# Altium project DiPho_digital.PrjPcb
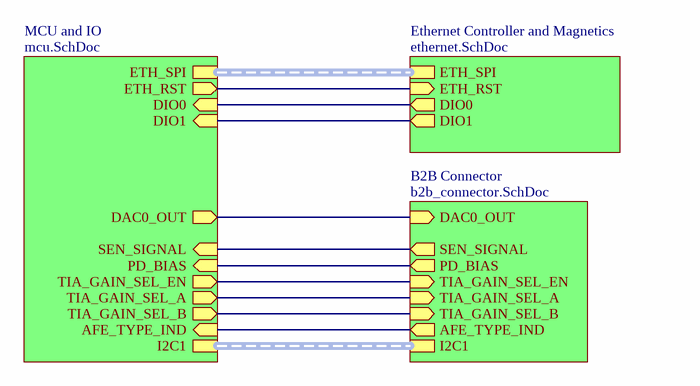
[diagram p0: DiPho_digital.SchDoc]
4 sheets, 65 parts. Net scope: hierarchical (ports join the sheet entries above them; power ports are global).
Board file: DiPho_digital.PcbDoc
Sheets:
  DiPho_digital.SchDoc
    MCU and IO = mcu.SchDoc
    Ethernet Controller and Magnetics = ethernet.SchDoc
    B2B Connector = b2b_connector.SchDoc

## Sheet DiPho_digital.SchDoc: DiPho digital
size 420 x 297 mm; Author: P. Daniel; CompanyName: WUT ISE; DrawnBy: P. Daniel; Organization: WUT ISE; Address1: WUT ISE; Address2: Nowowiejska 15/19 00-665 Warsaw; Address3: piotrmaciejdaniel@gmail.com; Revision: 1; SheetNumber: 1; SheetTotal: 4; ModifiedBy: -; CreateDate: 10-12.2021; CheckedDate: -; Title2: top schematic; DivGrp: WUT ISE; Designer: Piotr Daniel

### Sub-sheets
B2B Connector = b2b_connector.SchDoc: I2C1 (harness I2C), AFE_TYPE_IND (out), TIA_GAIN_SEL_B (in), TIA_GAIN_SEL_A (in), PD_BIAS (out), SEN_SIGNAL (out), DAC0_OUT (in), TIA_GAIN_SEL_EN (in)
Ethernet Controller and Magnetics = ethernet.SchDoc: ETH_SPI (harness ETH_SPI), ETH_RST (in), DIO0 (out), DIO1 (out)
MCU and IO = mcu.SchDoc: I2C1 (harness I2C), ETH_SPI (harness ETH_SPI), ETH_RST (out), AFE_TYPE_IND (in), TIA_GAIN_SEL_A (out), PD_BIAS (in), DAC0_OUT (out), TIA_GAIN_SEL_B (out), TIA_GAIN_SEL_EN (out), SEN_SIGNAL (in), DIO0 (in), DIO1 (in)

### Nets
AFE_TYPE_IND: sheet MCU and IO/AFE_TYPE_IND, sheet B2B Connector/AFE_TYPE_IND
DAC0_OUT: sheet MCU and IO/DAC0_OUT, sheet B2B Connector/DAC0_OUT
DIO0: sheet MCU and IO/DIO0, sheet Ethernet Controller and Magnetics/DIO0
DIO1: sheet MCU and IO/DIO1, sheet Ethernet Controller and Magnetics/DIO1
ETH_RST: sheet MCU and IO/ETH_RST, sheet Ethernet Controller and Magnetics/ETH_RST
PD_BIAS: sheet MCU and IO/PD_BIAS, sheet B2B Connector/PD_BIAS
SEN_SIGNAL: sheet MCU and IO/SEN_SIGNAL, sheet B2B Connector/SEN_SIGNAL
TIA_GAIN_SEL_A: sheet MCU and IO/TIA_GAIN_SEL_A, sheet B2B Connector/TIA_GAIN_SEL_A
TIA_GAIN_SEL_B: sheet MCU and IO/TIA_GAIN_SEL_B, sheet B2B Connector/TIA_GAIN_SEL_B
TIA_GAIN_SEL_EN: sheet MCU and IO/TIA_GAIN_SEL_EN, sheet B2B Connector/TIA_GAIN_SEL_EN

### Buses and harness runs
harness sheet B2B Connector/I2C1 = sheet MCU and IO/I2C1
harness sheet Ethernet Controller and Magnetics/ETH_SPI = sheet MCU and IO/ETH_SPI

### Notes on the sheet
- Project/Equipment
- Document
- Designer
- Drawn by
- Check.by
- Copyright WUT ISE 2021.
  This documentation describes Open Hardware and is licensed under the CERN OHL v.1.1. You may redistribute and modify this documentation under the terms of the CERN OHL v.1.1. (http://ohwr.org/CERNOHL). This documentation is distributed WITHOUT ANY EXPRESS OR IMPLIED WARRANTY, INCLUDING OF MERCHANTABILITY, SATISFACTORY QUALITY AND FITNESS FOR A PARTICULAR PURPOSE. Please see the CERN OHL v.1.1 for applicable conditions.
- Contact
- File
- Last Mod.
- Print Date
- Sheet
- Size
- A3
- of
- Rev

## Sheet mcu.SchDoc: DiPho digital
size 420 x 297 mm; Author: P. Daniel; CompanyName: WUT ISE; DrawnBy: P. Daniel; Organization: WUT ISE; Address1: WUT ISE; Address2: Nowowiejska 15/19 00-665 Warsaw; Address3: piotrmaciejdaniel@gmail.com; Revision: 1; SheetNumber: 2; SheetTotal: 4; ModifiedBy: -; CreateDate: 10-12.2021; CheckedDate: -; Title2: MCU and IO; DivGrp: WUT ISE; Designer: Piotr Daniel; ModifiedDate: -; ProjectName: Sensor Box
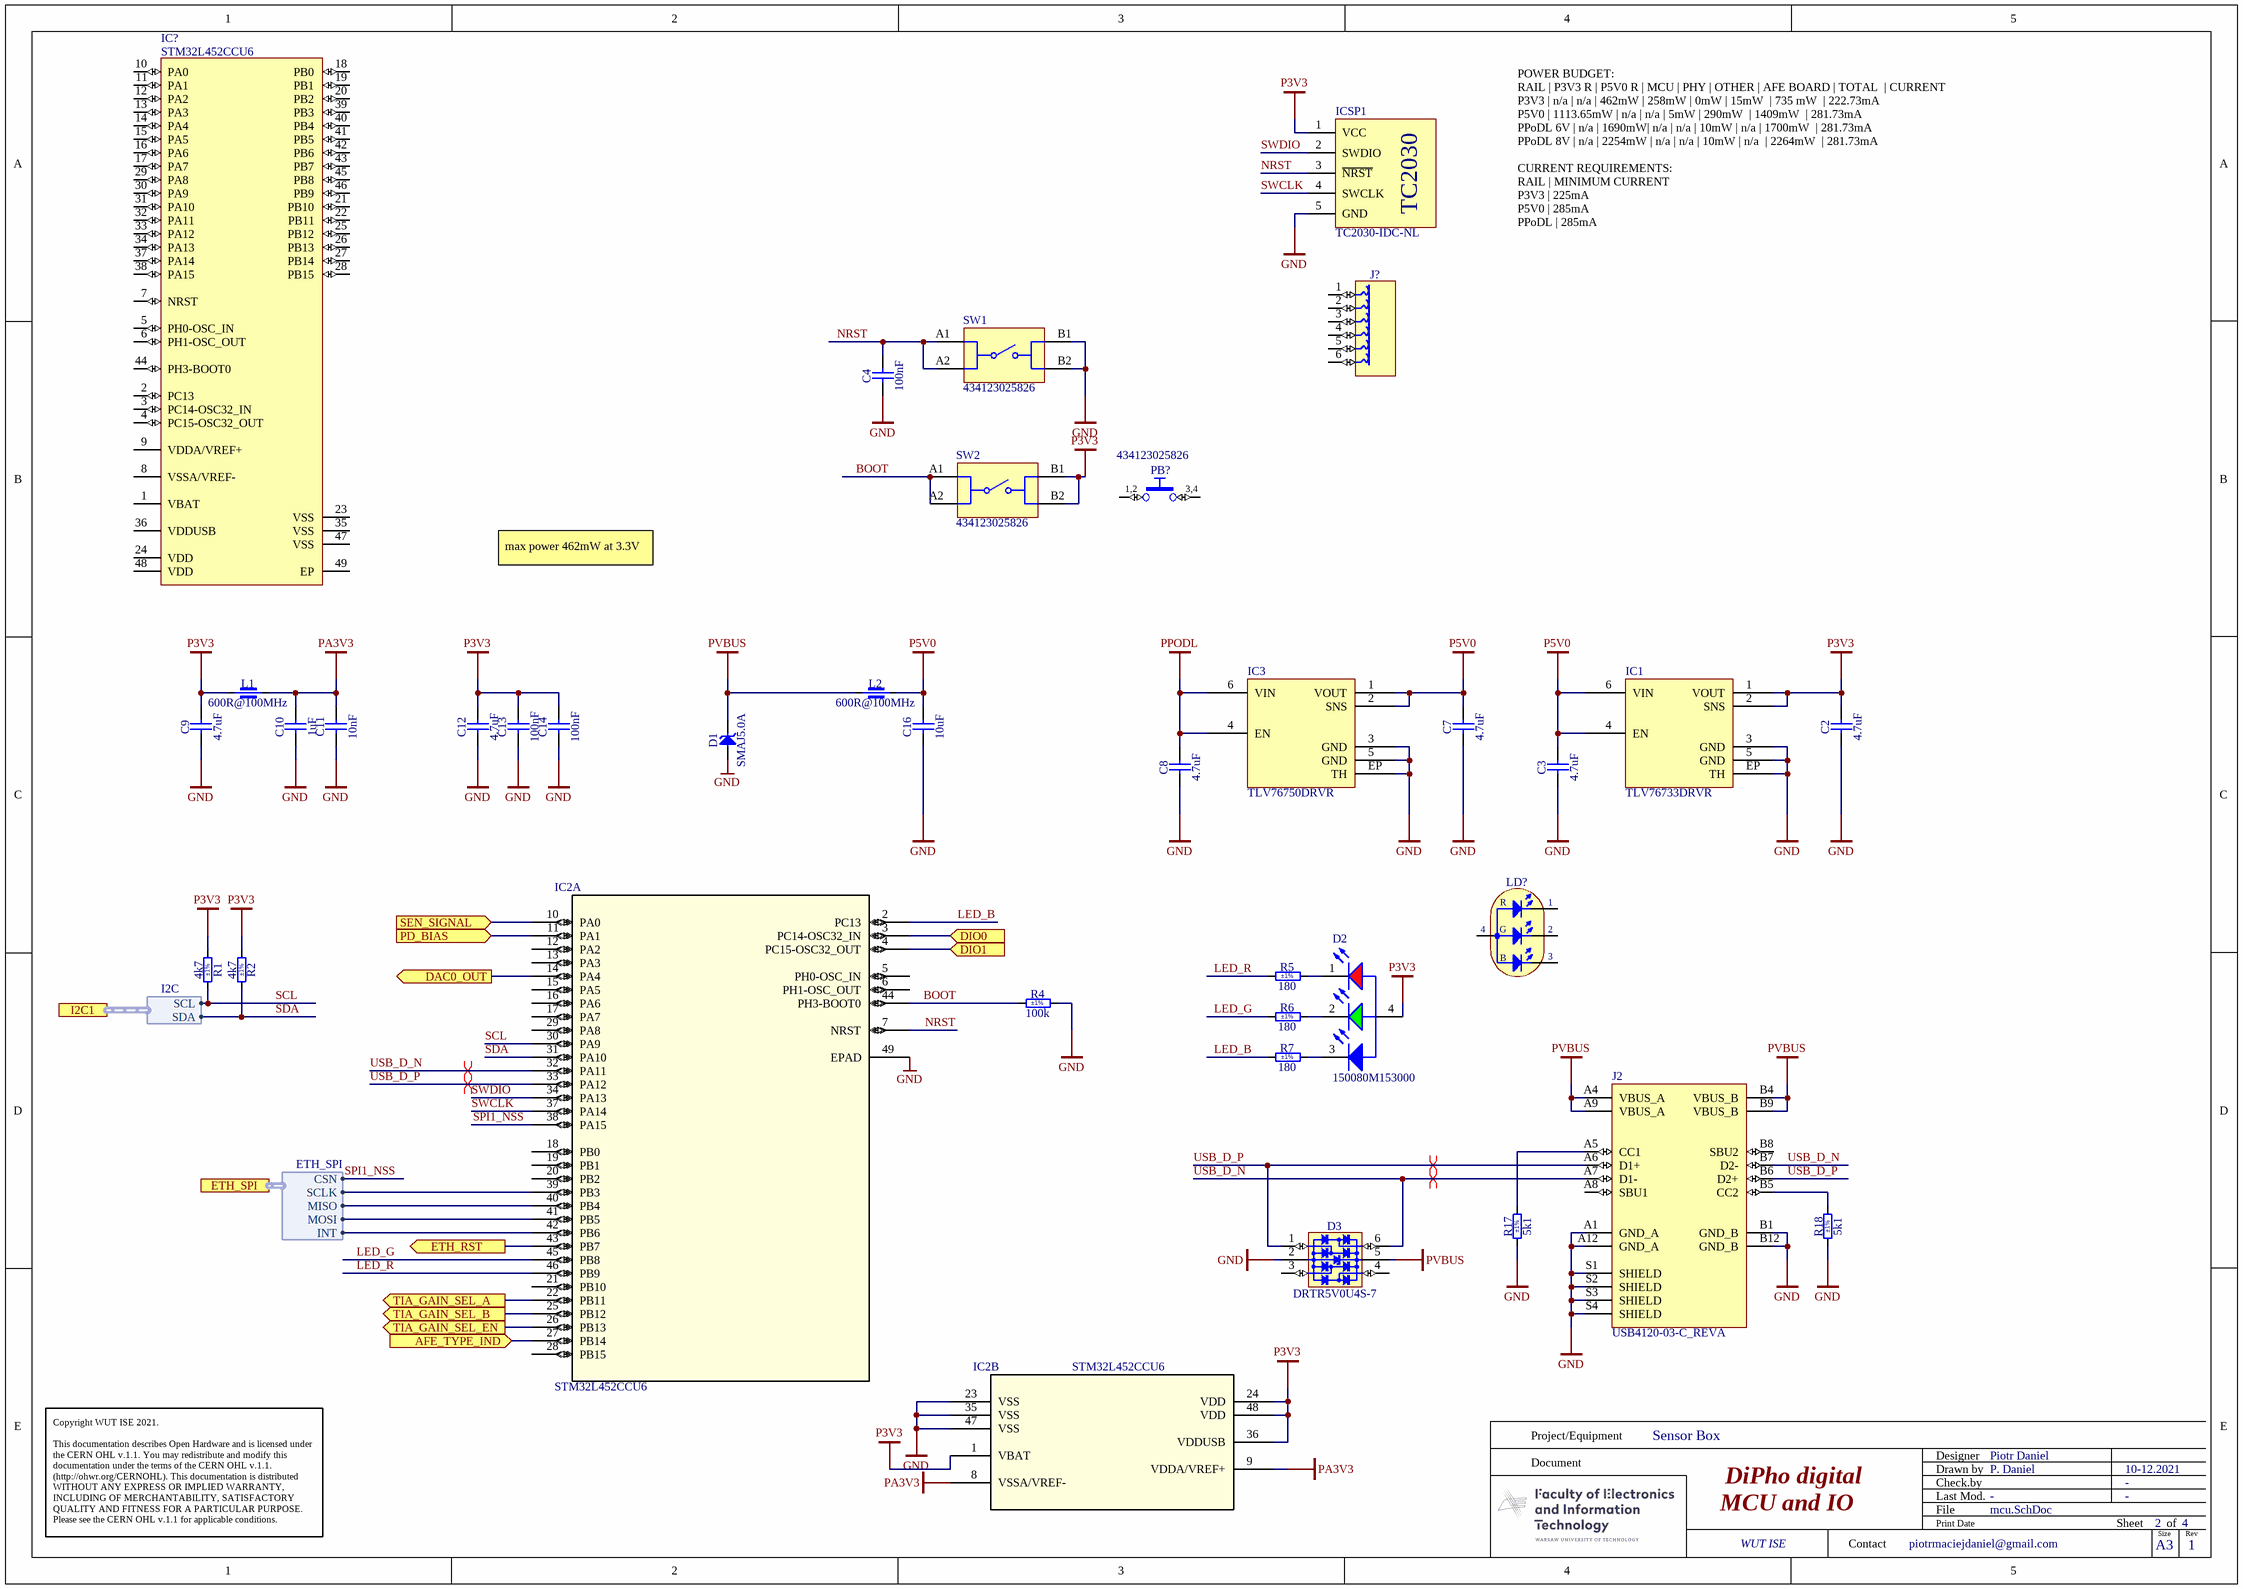
[diagram p1: mcu.SchDoc]

### Parts
(Parts that share a designator on the sheet are numbered #1, #2 ... from top to bottom, then left to right.)
C2  4.7uF  [CAPC1709X95N]
C3  4.7uF  [CAPC1709X95N]
C4  100nF  [CAPC1005X55N]
C7  4.7uF  [CAPC1709X95N]
C8  4.7uF  [CAPC1709X95N]
C9  4.7uF  [CAPC1709X95N]
C10  1uF  [CAPC1005X55N]
C11  10nF  [CAPC1005X55N]
C12  4.7uF  [CAPC1709X95N]
C13  100nF  [CAPC1005X55N]
C14  100nF  [CAPC1005X55N]
C16  10uF  [CAPC1608X80N]
D1  SMAJ5.0A  [DIOM5226X262N]
D2  150080M153000  [WL-SFCD_0805]
D3  DRTR5V0U4S-7  [SOT65P210X110-6N]
IC1  TLV76733DRVR  [SON65P200X80_HS-7N]
IC2  STM32L452CCU6  [UFQFPN48-7x7mm_STM-L]  (parts A,B of 2)
IC3  TLV76750DRVR  [SON65P200X80_HS-7N]
IC?  STM32L452CCU6  [QFN50P700X700X60-49N-S570]
ICSP1  TC2030-IDC-NL  [TC2030-IDC-NL]
J2  USB4120-03-C_REVA  [GCT_USB4120-03-C_REVA]
J?  TC2030-MCP  [TC2030-MCP-NL]  (value not drawn)
L1  600R@100MHz  [INDC1005X55N]
L2  600R@100MHz  [INDC1005X55N]
LD?  Red/Green/Blue  [LED_WURTH_150080M153000]  (value not drawn)
PB?  Manufacturer Part Number: 434123025826  [PB_WURTH_434123025826]  (hidden comment: Push Button)
R1  4k7  Tolerance: ±1%  [RESC1005X40N]
R2  4k7  Tolerance: ±1%  [RESC1005X40N]
R4  100k  Tolerance: ±1%  [RESC1005X40N]
R5  180  Tolerance: ±1%  [RESC1005X40N]
R6  180  Tolerance: ±1%  [RESC1005X40N]
R7  180  Tolerance: ±1%  [RESC1005X40N]
R17  5k1  Tolerance: ±1%  [RESC1005X40N]
R18  5k1  Tolerance: ±1%  [RESC1005X40N]
SW1#1  434123025826  [WS-TASV_L4.2W3.2H2.5_4341x30258x6]
SW2  434123025826  [WS-TASV_L4.2W3.2H2.5_4341x30258x6]

### Ports
AFE_TYPE_IND (in), DAC0_OUT (out), DIO0 (in), DIO1 (in), ETH_RST (out), ETH_SPI (harness ETH_SPI), I2C1 (harness I2C), PD_BIAS (in), SEN_SIGNAL (in), TIA_GAIN_SEL_A (out), TIA_GAIN_SEL_B (out), TIA_GAIN_SEL_EN (out)

### Harnesses
I2C: SCL, SDA
ETH_SPI: INT, SCLK, MISO, MOSI, CSN

### Nets
GND: C2.1 C3.1 C4.1 C7.1 C8.1 C9.1 C10.1 C11.1 C12.1 C13.1 C14.1 C16.1 D1.2(A) D3.2(GND) IC1.3(GND) IC1.5(GND) IC1.EP(TH) IC2.23(VSS) IC2.35(VSS) IC2.47(VSS) IC2.49(EPAD) IC3.3(GND) IC3.5(GND) IC3.EP(TH) ICSP1.5(GND) J2.A1(GND_A) J2.A12(GND_A) J2.B1(GND_B) J2.B12(GND_B) J2.S1(SHIELD) J2.S2(SHIELD) J2.S3(SHIELD) J2.S4(SHIELD) R4.2 R17.1 R18.1 SW1#1.B1 SW1#1.B2
P3V3: C2.2 C9.2 C12.2 C13.2 C14.2 D2.4(A) IC1.1(VOUT) IC1.2(SNS) IC2.1(VBAT) IC2.24(VDD) IC2.36(VDDUSB) IC2.48(VDD) ICSP1.1(VCC) L1.1 R1.2 R2.2 SW2.B1 SW2.B2
P5V0: C3.2 C7.2 C16.2 IC1.4(EN) IC1.6(VIN) IC3.1(VOUT) IC3.2(SNS) L2.2
PA3V3: C10.2 C11.2 IC2.8(VSSA/VREF-) IC2.9(VDDA/VREF+) L1.2
PPODL: C8.2 IC3.4(EN) IC3.6(VIN)
PVBUS: D1.1(C) D3.5(VBUS) J2.A4(VBUS_A) J2.A9(VBUS_A) J2.B4(VBUS_B) J2.B9(VBUS_B) L2.1
AFE_TYPE_IND: IC2.27(PB14) ; port AFE_TYPE_IND
BOOT: IC2.44(PH3-BOOT0) R4.1 SW2.A1 SW2.A2
DAC0_OUT: IC2.14(PA4) ; port DAC0_OUT
DIO0: IC2.3(PC14-OSC32_IN) ; port DIO0
DIO1: IC2.4(PC15-OSC32_OUT) ; port DIO1
ETH_RST: IC2.43(PB7) ; port ETH_RST
LED_B: IC2.2(PC13) R7.1
LED_G: IC2.45(PB8) R6.1
LED_R: IC2.46(PB9) R5.1
NRST: C4.2 IC2.7(NRST) ICSP1.3(~{NRST}) SW1#1.A1 SW1#1.A2
PD_BIAS: IC2.11(PA1) ; port PD_BIAS
SCL: IC2.30(PA9) R1.1 ; port I2C1.SCL
SDA: IC2.31(PA10) R2.1 ; port I2C1.SDA
SEN_SIGNAL: IC2.10(PA0) ; port SEN_SIGNAL
SPI1_NSS: IC2.38(PA15) ; port ETH_SPI.CSN
SWCLK: IC2.37(PA14) ICSP1.4(SWCLK)
SWDIO: IC2.34(PA13) ICSP1.2(SWDIO)
TIA_GAIN_SEL_A: IC2.22(PB11) ; port TIA_GAIN_SEL_A
TIA_GAIN_SEL_B: IC2.25(PB12) ; port TIA_GAIN_SEL_B
TIA_GAIN_SEL_EN: IC2.26(PB13) ; port TIA_GAIN_SEL_EN
USB_D_N: D3.6(I/O4) IC2.32(PA11) J2.A7(D1-) J2.B7(D2-)
USB_D_P: D3.1(I/O1) IC2.33(PA12) J2.A6(D1+) J2.B6(D2+)
NetD2_1: D2.1(K) R5.2
NetD2_2: D2.2(K) R6.2
NetD2_3: D2.3(K) R7.2
NetIC2_39: IC2.39(PB3) ; port ETH_SPI.SCLK
NetIC2_40: IC2.40(PB4) ; port ETH_SPI.MISO
NetIC2_41: IC2.41(PB5) ; port ETH_SPI.MOSI
NetIC2_42: IC2.42(PB6) ; port ETH_SPI.INT
NetJ2_A5: J2.A5(CC1) R17.2
NetJ2_B5: J2.B5(CC2) R18.2
NetPB?_1: PB?.1 PB?.2
NetPB?_3: PB?.3 PB?.4

Not connected (* = marked no-connect by the designer): D3 3(I/O2) 4(I/O3); IC2 5(PH0-OSC_IN) 6(PH1-OSC_OUT) 12(PA2) 13(PA3) 15(PA5) 16(PA6) 17(PA7) 18(PB0) 19(PB1) 20(PB2) 21(PB10) 28(PB15) 29(PA8); IC? 1(VBAT) 2(PC13) 3(PC14-OSC32_IN) 4(PC15-OSC32_OUT) 5(PH0-OSC_IN) 6(PH1-OSC_OUT) 7(NRST) 8(VSSA/VREF-) 9(VDDA/VREF+) 10(PA0) 11(PA1) 12(PA2) 13(PA3) 14(PA4) 15(PA5) 16(PA6) 17(PA7) 18(PB0) 19(PB1) 20(PB2) 21(PB10) 22(PB11) 23(VSS) 24(VDD) 25(PB12) 26(PB13) 27(PB14) 28(PB15) 29(PA8) 30(PA9) 31(PA10) 32(PA11) 33(PA12) 34(PA13) 35(VSS) 36(VDDUSB) 37(PA14) 38(PA15) 39(PB3) 40(PB4) 41(PB5) 42(PB6) 43(PB7) 44(PH3-BOOT0) 45(PB8) 46(PB9) 47(VSS) 48(VDD) 49(EP); J2 A8(SBU1) B8(SBU2); J? 1 2 3 4 5 6; LD? 1(CR) 2(CG) 3(CR) 4(AC)

### Layout directives
differential pair: USB_D_N, USB_D_P

### Notes on the sheet
- POWER BUDGET:
  RAIL	| P3V3 R	| P5V0 R	| MCU	| PHY	| OTHER	| AFE BOARD	| TOTAL		| CURRENT
  P3V3	| n/a	| n/a	| 462mW	| 258mW	| 0mW	| 15mW		| 735 mW		| 222.73mA
  P5V0	| 1113.65mW	| n/a	| n/a	| 5mW	| 290mW		| 1409mW		| 281.73mA
  PPoDL 6V	| n/a	| 1690mW| n/a	| n/a	| 10mW	| n/a	| 1700mW		| 281.73mA
  PPoDL 8V	| n/a	| 2254mW	| n/a	| n/a	| 10mW	| n/a		| 2264mW		| 281.73mA
  CURRENT REQUIREMENTS:
  RAIL	| MINIMUM CURRENT
  P3V3	| 225mA
  P5V0	| 285mA
  PPoDL	| 285mA
- max power 462mW at 3.3V
- Project/Equipment
- Document
- Designer
- Drawn by
- Check.by
- Copyright WUT ISE 2021.
  This documentation describes Open Hardware and is licensed under the CERN OHL v.1.1. You may redistribute and modify this documentation under the terms of the CERN OHL v.1.1. (http://ohwr.org/CERNOHL). This documentation is distributed WITHOUT ANY EXPRESS OR IMPLIED WARRANTY, INCLUDING OF MERCHANTABILITY, SATISFACTORY QUALITY AND FITNESS FOR A PARTICULAR PURPOSE. Please see the CERN OHL v.1.1 for applicable conditions.
- Contact
- File
- Last Mod.
- Print Date
- Sheet
- Size
- A3
- of
- Rev
- (in symbol LED_WURTH_150080M153000) R; G; B
- (in symbol PB_WURTH_434123025826) 1,2; 3,4
- (in symbol TC2030-IDC-NL) TC2030

### Library data of the parts
C2 C3 C7-C9 C12 = CC0603_4.7UF_16V_10%_X5R: Non-polarised capacitor; Part Description: SMD Multilayer Chip Ceramic Capacitor; Manufacturer: GENERIC; Manufacturer1 Part Number: EMK107ABJ475KA-T; Voltage: 16V; TC: X5R; Tolerance: ±10%; Part Number: CC0603_4.7UF_16V_10%_X5R; Component Kind: Standard; Component Type: Standard; Pin Count: 2; Value: 4.7uF; Status: None; Manufacturer Part Number: CC0603_4.7UF_16V_10%_X5R; Case: 0603; Mounted: Yes; Socket: No; SMD: Yes; Sense: No; Manufacturer1 Example: TAIYO YUDEN; Manufacturer1 ComponentHeight: 0.95mm; HelpURL: \\cern.ch\dfs\Applications\Altium\Datasheets\CC0603_X7R_TAIYO-YUDEN_HIGH-VALUE.pdf; Author: CERN DEM JLC; CreateDate: 16.12.2013; LatestRevisionDate: 16.09.2014
C4 C13 C14 = CC0402_100NF_16V_10%_X7R: Non-polarised capacitor; Part Description: SMD Multilayer Chip Ceramic Capacitor; Manufacturer: GENERIC; Manufacturer1 Part Number: GRM155R71C104KA88D; Voltage: 16V; TC: X7R; Tolerance: ±10%; Part Number: CC0402_100NF_16V_10%_X7R; Component Kind: Standard; Component Type: Standard; Pin Count: 2; Value: 100nF; Status: Not Recommended; Manufacturer Part Number: CC0402_100NF_16V_10%_X7R; Case: 0402; Mounted: Yes; Socket: No; SMD: Yes; Sense: No; Manufacturer1 Example: MURATA; Manufacturer1 ComponentHeight: 0.55mm; HelpURL: \\cern.ch\dfs\Applications\Altium\Datasheets\CC0402_X7R_MURATA_GRM.pdf; Author: CERN DEM JLC; CreateDate: 05.12.2013; LatestRevisionDate: 03.12.2007
C10 = CC0402_1UF_16V_10%_X5R: Non-polarised capacitor; Part Description: SMD Multilayer Chip Ceramic Capacitor; Manufacturer: GENERIC; Manufacturer1 Part Number: C1005X5R1C105KT; Voltage: 16V; TC: X5R; Tolerance: ±10%; Part Number: CC0402_1UF_16V_10%_X5R; Component Kind: Standard; Component Type: Standard; Pin Count: 2; Value: 1uF; Status: Preferred; Manufacturer Part Number: CC0402_1UF_16V_10%_X5R; Case: 0402; Mounted: Yes; Socket: No; SMD: Yes; Sense: No; Manufacturer1 Example: TDK; Manufacturer1 ComponentHeight: 0.55mm; HelpURL: \\cern.ch\dfs\Applications\Altium\Datasheets\CC0402_X5R_TDK_C.pdf; Author: CERN DEM JLC; CreateDate: 25.10.2012; LatestRevisionDate: 25.10.2012
C11 = CC0402_10NF_16V_10%_X7R: Non-polarised capacitor; Part Description: SMD Multilayer Chip Ceramic Capacitor; Manufacturer: GENERIC; Manufacturer1 Part Number: 223878715636; Voltage: 16V; TC: X7R; Tolerance: ±10%; Part Number: CC0402_10NF_16V_10%_X7R; Component Kind: Standard; Component Type: Standard; Pin Count: 2; Value: 10nF; Status: Not Recommended; Manufacturer Part Number: CC0402_10NF_16V_10%_X7R; Case: 0402; Mounted: Yes; Socket: No; SMD: Yes; Sense: No; Manufacturer1 Example: PHYCOMP; Manufacturer1 ComponentHeight: 0.55mm; HelpURL: \\cern.ch\dfs\Applications\Altium\Datasheets\CC0402_X7R_PHYCOMP.pdf; Author: CERN DEM JLC; CreateDate: 03.12.2007; LatestRevisionDate: 03.12.2007
C16 = CC0603_10UF_10V_10%_X5R: Non-polarised capacitor; Part Description: SMD Multilayer Chip Ceramic Capacitor; Manufacturer: GENERIC; Manufacturer1 Part Number: GRM188R61A106KE69D; Voltage: 10V; TC: X5R; Tolerance: ±10%; Part Number: CC0603_10UF_10V_10%_X5R; Component Kind: Standard; Component Type: Standard; Pin Count: 2; Value: 10uF; Status: None; Manufacturer Part Number: CC0603_10UF_10V_10%_X5R; Case: 0603; Mounted: Yes; Socket: No; SMD: Yes; Sense: No; Manufacturer1 Example: MURATA; Manufacturer1 ComponentHeight: 0.8mm; HelpURL: \\cern.ch\dfs\Applications\Altium\Datasheets\CC0603_MURATA_GRM188R61A106KE69D.pdf; Author: CERN DEM JLC; CreateDate: 31.01.2017; LatestRevisionDate: 31.01.2017
D1 = SMAJ5.0A: Transient Voltage Suppressor Diode (Uni-Directional); Part Description: Surface Mount Uni-directional Transient Voltage Suppressor Diode; Manufacturer: BOURNS; Voltage: 5V; Power: 400W; PressFit: No; Bonding: No; Part Number: SMAJ5.0A; Component Kind: Standard; Component Type: Standard; Device: SMAJ5.0A; PackageDescription: DO-214-AC/SMA Diode, Molded Body; 5.21mm L X 2.605mm W X 2.62mm H, IPC Medium Density; Manufacturer Part Number: SMAJ5.0A; Pin Count: 2; Case: DO-214AC; Mounted: Yes; Socket: No; SMD: Yes; Sense: No; ComponentHeight: 2.62mm; HelpURL: \\cern.ch\dfs\Applications\Altium\Datasheets\SMAJ5.0A.pdf; Author: CERN DEM MR; CreateDate: 14.07.2016; LatestRevisionDate: 14.07.2016
D2 = CMP-03913-82270974-1: 150080M153000 WL-SFCD SMT full-color Chip LED Diffused; Max Reverse Voltage (DC): 5V; Luminous Intensity: 70mcd; Forward Current: 60mA; Forward Voltage: 2V; Dominant Wavelength: 525nm; Power Dissipation: 48mW; Peak Wavelength: 468nm; Viewing Angle: 120°; RoHS: Non-Compliant; Width: 1.3mm; Length: 2mm; Packaging: Tape and Reel; NexarPartId: 82270974; Height: 500µm
D3 = D_TVS_DRTR5V0U4S-7: Integrated Quad Ultra-Low Capacitance ESD Protection; Part Description: Integrated Quad Ultra-Low Capacitance ESD (±8kV) Protection; Manufacturer: DIODES; PressFit: No; Bonding: No; Status Comment: Active; Part Number: DRTR5V0U4S-7; Component Kind: Standard; Component Type: Standard; Device: DRTR5V0U4S-7; PackageDescription: SOT363, SC70-6, 0.65mm Pitch; 6 Pin, 1.25mm W X 2.00mm L X 1.10mm H body, IPC Medium Density; Status: Active; Manufacturer Part Number: DRTR5V0U4S-7; Pin Count: 6; Case: SOT363; Mounted: Yes; Socket: No; SMD: Yes; Sense: No; ComponentHeight: 1.1mm; HelpURL: \\cern.ch\dfs\Applications\Altium\Datasheets\PRTR5V0U4Y.pdf; Author: GK; CreateDate: 24.01.2017; LatestRevisionDate: 14.09.2020
IC1 = TLV76733DRVR: Precision Linear Voltage Regulator Positive 3.3V 1A 6-Pin WSON T/R; Manufacturer: Texas Instruments; Manufacturer Part Number: TLV76733DRVR; RoHS: Yes; Category: Voltage Regulators - Linear; Stock 1: 13794; Pricing 1: 1=0,92000, 10=0,82200, 25=0,78040, 100=0,64120, 250=0,59936, 500=0,52968, 1000=0,42080 (USD); ComponentLink1URL: http://www.ti.com/general/docs/suppproductinfo.tsp?distId=10&amp;gotoUrl=http%3A%2F%2Fwww.ti.com%2Flit%2Fgpn%2Ftlv767&src-supplier=Digi-Key; ComponentLink1Description: http://www.ti.com/general/docs/suppproductinfo.tsp?distId=10&amp;gotoUrl=http%3A%2F%2Fwww.ti.com%2Flit%2Fgpn%2Ftlv767&src-supplier=Digi-Key
IC2 = UPC_STM32L452CCU6: No Description Available; Mfr_Name: STMicroelectronics; RefDes: RefDes; Type: Type
IC3 = TLV76750DRVR: Precision Linear Voltage Regulator Positive 5V 1A 6-Pin WSON T/R; Manufacturer: Texas Instruments; Supplier 1: Digi-Key; Manufacturer Part Number: TLV76750DRVR; RoHS: Yes; Category: Voltage Regulators - Linear; Stock 1: 13794; Pricing 1: 1=0,92000, 10=0,82200, 25=0,78040, 100=0,64120, 250=0,59936, 500=0,52968, 1000=0,42080 (USD); ComponentLink1URL: http://www.ti.com/general/docs/suppproductinfo.tsp?distId=10&amp;gotoUrl=http%3A%2F%2Fwww.ti.com%2Flit%2Fgpn%2Ftlv767&src-supplier=Digi-Key; ComponentLink1Description: http://www.ti.com/general/docs/suppproductinfo.tsp?distId=10&amp;gotoUrl=http%3A%2F%2Fwww.ti.com%2Flit%2Fgpn%2Ftlv767&src-supplier=Digi-Key; Supplier Part Number 1: 296-TLV76750DRVRCT-ND
IC? = STM32L452CCU6: Ultra-low-power Arm® Cortex®-M4 32-bit MCU+FPU, 100DMIPS, up to 512KB Flash, 160KB SRAM, analog, audio, ext. SMPS; Manufacturer: ST MICROELECTRONICS; PressFit: No; Bonding: No; Part Number: STM32L452CCU6; Component Kind: Standard; Component Type: Standard; Device: STM32L452CCU6; PackageDescription: QFN, 0.50mm Pitch, Square; 48 Pin, 7.00mm L X 7.00mm W X 0.60mm H body (w/Thermal Tab 5.7 X 5.7mm), IPC Medium Density; Part Description: Ultra-low-power Arm® Cortex®-M4 32-bit MCU+FPU, 100DMIPS, up to 512KB Flash, 160KB SRAM, analog, audio, ext. SMPS; Manufacturer Part Number: STM32L452CCU6; Pin Count: 49; Case: QFN48; Mounted: Yes; Socket: No; SMD: Yes; Sense: No; ComponentHeight: 0.6mm; HelpURL: \\cern.ch\dfs\Applications\Altium\Datasheets\STM32L452.pdf; Author: CERN DEM HF; CreateDate: 13.02.2025; LatestRevisionDate: 13.02.2025
ICSP1 = TC2030-IDC-NL: Tag-Connect 6-Pin with No Legs
J? = TC2030-MCP-NL: TC2030-MCP and TC2030-MCP-NL Pad Contact; Part Description: 6 X 31mil Diameter SMD Pad For TC2030-MCP No Leg Connector; Mounted: No; Part Number: TC2030-MCP-NL; Component Kind: Standard (No BOM); Component Type: Standard (No BOM); Pin Count: 6; Family: TC2030-MCP; Socket: No; SMD: Yes; Sense: No; Status: None; ComponentHeight: 0mm; HelpURL: \\cern.ch\dfs\Applications\Altium\Datasheets\TC2030-MCP-NL.pdf; Author: CERN DEM HF; CreateDate: 27.03.2023; LatestRevisionDate: 27.03.2023; PackageDescription: 6 X 31mil Diameter SMD Pad For TC2030-MCP No Leg Connector
L1 L2 = IND0402_MURATA_BLM15HD601SN1: Part Description: SMD EMIFIL Suppression Chip Ferrite Bead; Manufacturer: MURATA; Manufacturer Part Number: BLM15HD601SN1D; Power: 300mA; Resistance: 0.85R; Tolerance: ±25%; Part Number: IND0402_MURATA_BLM15HD601SN1; Component Kind: Standard; Component Type: Standard; Pin Count: 2; Value: 600R@100MHz; Status: None; Case: 0402; Mounted: Yes; Socket: No; SMD: Yes; Sense: No; ComponentHeight: 0.55mm; HelpURL: \\cern.ch\dfs\Applications\Altium\Datasheets\IND0402_MURATA_BLM15H.pdf; Author: CERN DEM JLC; CreateDate: 28.02.2012; LatestRevisionDate: 25.10.2018
LD? = LED_WURTH_150080M153000: Tricolor LEDs 1 Common Anode, 2 Cathode Red, 3 Cathode Green, 4 Cathode Blue; Part Description: Tri-Color (Red/Green/Blue), Body 2.0mm X 1.3mm X 0.5mm; Manufacturer: WURTH ELEKTRONIK; PressFit: No; Bonding: No; Part Number: LED_WURTH_150080M153000; Component Kind: Standard; Component Type: Standard; Color: Red/Green/Blue; PackageDescription: Tri-Color (Red/Green/Blue), Body 2.0mm X 1.3mm X 0.5mm; Manufacturer Part Number: 150080M153000; Pin Count: 4; Mounted: Yes; Socket: No; SMD: Yes; Sense: No; ComponentHeight: 0.5mm; HelpURL: \\cern.ch\dfs\Applications\Altium\Datasheets\LED_WURTH_150080M153000.pdf; Author: CERN DEM HF; CreateDate: 14.02.2025; LatestRevisionDate: 14.02.2025
PB? = PB_WURTH_434123025826: Push-Button Switch SPST; Part Description: Tactile Switch SPST-NO Top Actuated Surface Mount; Manufacturer: WURTH; PressFit: No; Part Number: PB_WURTH_434123025826; Component Kind: Standard; Component Type: Standard; Pin Count: 4; PackageDescription: Body L 4.6mm x W 3.2mm x H 2.7mm - Tactil Switch; Family: Push Button; Mounted: Yes; Socket: No; SMD: No; Sense: No; Status: None; ComponentHeight: 2.7mm; HelpURL: \\cern.ch\dfs\Applications\Altium\Datasheets\PB_WURTH_434123025826.pdf; Author: CERN DEM HF; CreateDate: 13.02.2025; LatestRevisionDate: 13.02.2025
R1 R2 = R0402_4K7_1%_0.0625W_100PPM: Resistor - 1%; Part Description: General Purpose Thick Film Chip Resistor; Manufacturer: GENERIC; Manufacturer1 Part Number: 232270674702L; TC: ±100ppm/°C; PressFit: No; Part Number: R0402_4K7_1%_0.0625W_100PPM; Component Kind: Standard; Component Type: Standard; Pin Count: 2; Value: 4k7; Status: Not Recommended; Power: 0.0625W; Manufacturer Part Number: R0402_4K7_1%_0.0625W_100PPM; Case: 0402; Mounted: Yes; Sense: No; Socket: No; SMD: Yes; Manufacturer1 Example: YAGEO PHYCOMP; Manufacturer1 ComponentHeight: 0.4mm; HelpURL: \\cern.ch\dfs\Applications\Altium\Datasheets\R0402_Phycomp_RC0402.pdf; Author: CERN DEM JLC; CreateDate: 03.12.2007; LatestRevisionDate: 17.10.2012
R4 = R0402_100K_1%_0.0625W_100PPM: Resistor - 1%; Part Description: General Purpose Thick Film Chip Resistor; Manufacturer: GENERIC; Manufacturer1 Part Number: 232270671004L; TC: ±100ppm/°C; PressFit: No; Part Number: R0402_100K_1%_0.0625W_100PPM; Component Kind: Standard; Component Type: Standard; Pin Count: 2; Value: 100k; Status: Not Recommended; Power: 0.0625W; Manufacturer Part Number: R0402_100K_1%_0.0625W_100PPM; Case: 0402; Mounted: Yes; Sense: No; Socket: No; SMD: Yes; Manufacturer1 Example: YAGEO PHYCOMP; Manufacturer1 ComponentHeight: 0.4mm; HelpURL: \\cern.ch\dfs\Applications\Altium\Datasheets\R0402_Phycomp_RC0402.pdf; Author: CERN DEM JLC; CreateDate: 03.12.2007; LatestRevisionDate: 17.10.2012
R5-R7 = R0402_180R_1%_0.0625W_100PPM: Resistor - 1%; Part Description: General Purpose Thick Film Chip Resistor; Manufacturer: GENERIC; Manufacturer1 Part Number: 232270671801L; TC: ±100ppm/°C; PressFit: No; Part Number: R0402_180R_1%_0.0625W_100PPM; Component Kind: Standard; Component Type: Standard; Pin Count: 2; Value: 180; Status: Not Recommended; Power: 0.0625W; Manufacturer Part Number: R0402_180R_1%_0.0625W_100PPM; Case: 0402; Mounted: Yes; Sense: No; Socket: No; SMD: Yes; Manufacturer1 Example: YAGEO PHYCOMP; Manufacturer1 ComponentHeight: 0.4mm; HelpURL: \\cern.ch\dfs\Applications\Altium\Datasheets\R0402_Phycomp_RC0402.pdf; Author: CERN DEM JLC; CreateDate: 03.12.2007; LatestRevisionDate: 17.10.2012
R17 R18 = R0402_5K1_1%_0.0625W_100PPM: Resistor - 1%; Part Description: General Purpose Thick Film Chip Resistor; Manufacturer: GENERIC; Manufacturer1 Part Number: 232270675102L; TC: ±100ppm/°C; PressFit: No; Part Number: R0402_5K1_1%_0.0625W_100PPM; Component Kind: Standard; Component Type: Standard; Pin Count: 2; Value: 5k1; Status: Not Recommended; Power: 0.0625W; Manufacturer Part Number: R0402_5K1_1%_0.0625W_100PPM; Case: 0402; Mounted: Yes; Sense: No; Socket: No; SMD: Yes; Manufacturer1 Example: YAGEO PHYCOMP; Manufacturer1 ComponentHeight: 0.4mm; HelpURL: \\cern.ch\dfs\Applications\Altium\Datasheets\R0402_Phycomp_RC0402.pdf; Author: CERN DEM JLC; CreateDate: 03.12.2007; LatestRevisionDate: 17.10.2012
SW1#1 SW2 = CMP-03913-99472341-1: 434123025826 Tactile Switch, 0.05A, 16Vdc, 260Gf, Smd Rohs Compliant: Yes; Insulation Resistance: 100MΩ; Voltage Rating: 16V; Current Rating: 50mA; Max Operating Temperature: 85°C; NexarPartId: 99472341; Height: 2.5mm; Contact Plating: Silver; Min Operating Temperature: -40°C; Packaging: Tape and Reel; RoHS: Compliant
J2 = USB4120-03-C_REVA: Package: None; MP: USB4120-03-C_REVA; Value: *; Availability: Unavailable; Price: None

## Sheet ethernet.SchDoc: DiPho digital
size 420 x 297 mm; Author: P. Daniel; CompanyName: WUT ISE; DrawnBy: P. Daniel; Organization: WUT ISE; Address1: WUT ISE; Address2: Nowowiejska 15/19 00-665 Warsaw; Address3: piotrmaciejdaniel@gmail.com; Revision: 1; SheetNumber: 3; SheetTotal: 4; ModifiedBy: -; CreateDate: 10-12.2021; CheckedDate: -; Title2: PHY schematic; DivGrp: WUT ISE; Designer: Piotr Daniel; ModifiedDate: -; ProjectName: Sensor Box
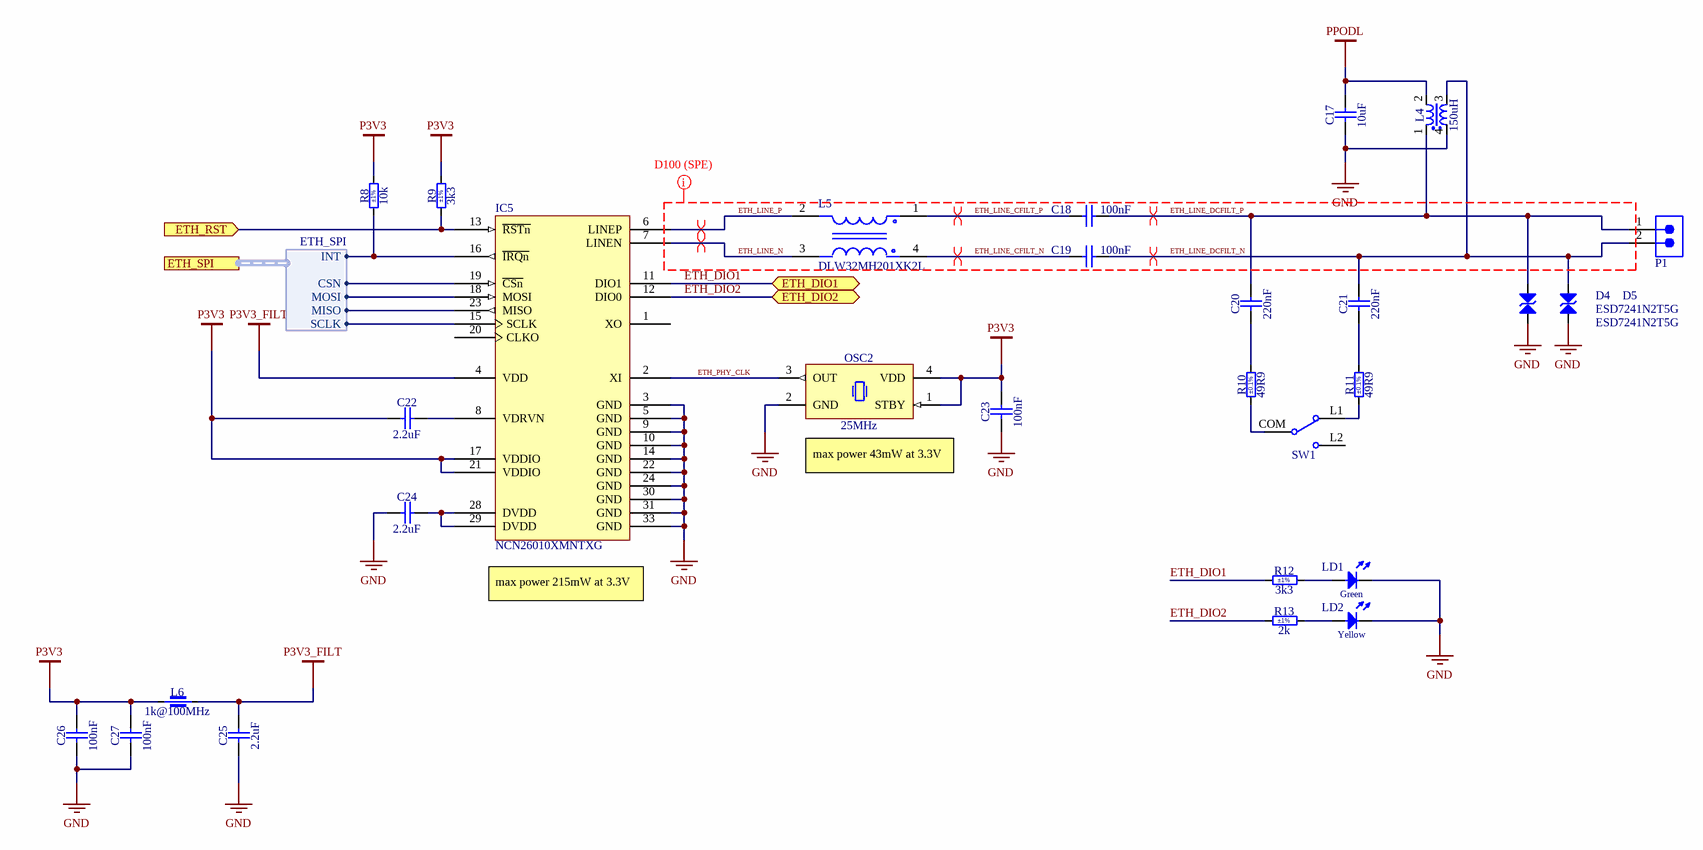
[diagram p2: ethernet.SchDoc]

### Parts
(Parts that share a designator on the sheet are numbered #1, #2 ... from top to bottom, then left to right.)
C17  10uF  [CAPC2012X145N]
C18  100nF  [CAPC1005X55N]
C19  100nF  [CAPC1005X55N]
C20  220nF  [CAPC2012X135N]
C21  220nF  [CAPC2012X135N]
C22  2.2uF  [CAPC1005X55N]
C23  100nF  [CAPC1005X55N]
C24  2.2uF  [CAPC1005X55N]
C25  2.2uF  [CAPC1005X55N]
C26  100nF  [CAPC1005X55N]
C27  100nF  [CAPC1005X55N]
D4  ESD7241N2T5G  [DFN65P100X40-2N]
D5  ESD7241N2T5G  [DFN65P100X40-2N]
IC5  NCN26010XMNTXG  [QFN40P400X400X100_HS-33N]
L4  150uH  [IND_COILCRAFT_LPD5030]
L5  DLW32MH201XK2L  [FP-DLW32MH201XK2L-MFG]
L6  1k@100MHz  [INDC1608X100N]
LD1  Green  [LED_LITEON_LTST-C193KGKT-5A]
LD2  Yellow  [LED_LITEON_LTST-C193KSKT-5A]
OSC2  25MHz  [OSC_ABRACON_ASE]
P1  691347000002B  [691347000002B]  (value not drawn)
R8  10k  Tolerance: ±1%  [RESC1005X40N]
R9  3k3  Tolerance: ±1%  [RESC1608X55N]
R10  49R9  Tolerance: ±0.1%  [RESC1608X55N]
R11  49R9  Tolerance: ±0.1%  [RESC1608X55N]
R12  3k3  Tolerance: ±1%  [RESC1005X40N]
R13  2k  Tolerance: ±1%  [RESC1005X40N]
SW1#2  450301014042  [450301014042]  (value not drawn)

### Ports
ETH_DIO1 (bidir), ETH_DIO2 (bidir), ETH_RST (in), ETH_SPI (harness ETH_SPI)

### Harnesses
ETH_SPI: CSN, SCLK, MOSI, INT, MISO

### Nets
GND: C17.1 C23.1 C24.1 C25.1 C26.1 C27.1 D4.1 D5.1 IC5.3(GND) IC5.5(GND) IC5.9(GND) IC5.10(GND) IC5.14(GND) IC5.22(GND) IC5.24(GND) IC5.30(GND) IC5.31(GND) IC5.33(GND) L4.4 LD1.1(C) LD2.1(C) OSC2.2(GND)
P3V3: C22.1 C23.2 C26.2 C27.2 IC5.17(VDDIO) IC5.21(VDDIO) L6.1 OSC2.1(STBY) OSC2.4(VDD) R8.2 R9.2
P3V3_FILT: C25.2 IC5.4(VDD) L6.2
PPODL: C17.2 L4.2
ETH_DIO1: IC5.11(DIO1) R12.1 ; port ETH_DIO1
ETH_DIO2: IC5.12(DIO0) R13.1 ; port ETH_DIO2
ETH_LINE_CFILT_N: C19.1 L5.4
ETH_LINE_CFILT_P: C18.1 L5.1
ETH_LINE_DCFILT_N: C19.2 C21.2 D4.2 L4.3 P1.2
ETH_LINE_DCFILT_P: C18.2 C20.2 D5.2 L4.1 P1.1
ETH_LINE_N: IC5.7(LINEN) L5.3
ETH_LINE_P: IC5.6(LINEP) L5.2
ETH_PHY_CLK: IC5.2(XI) OSC2.3(OUT)
ETH_RST: IC5.13(~{RSTn}) R9.1 ; port ETH_RST
SPI1_NSS: IC5.19(~{CSn}) ; port ETH_SPI.CSN
NetC20_1: C20.1 R10.2
NetC21_1: C21.1 R11.2
NetC22_2: C22.2 IC5.8(VDRVN)
NetC24_2: C24.2 IC5.28(DVDD) IC5.29(DVDD)
NetIC2_39: IC5.15(SCLK) ; port ETH_SPI.SCLK
NetIC2_40: IC5.23(MISO) ; port ETH_SPI.MISO
NetIC2_41: IC5.18(MOSI) ; port ETH_SPI.MOSI
NetIC2_42: IC5.16(~{IRQn}) R8.1 ; port ETH_SPI.INT
NetLD1_2: LD1.2(A) R12.2
NetLD2_2: LD2.2(A) R13.2
NetR10_1: R10.1 SW1#2.COM
NetR11_1: R11.1 SW1#2.L1

Not connected (* = marked no-connect by the designer): IC5 1(XO) 20(CLKO); SW1#2 L2

### Layout directives
differential pair: ETH_LINE_CFILT_N, ETH_LINE_CFILT_P, ETH_LINE_DCFILT_N, ETH_LINE_DCFILT_P, ETH_LINE_N, ETH_LINE_P
rule Differential Pairs Routing [Pref Gap = 5mil    Min Gap  = 5mil    Max Gap  = 5milPref Width = 9.076mil    Min Width  = 3.515mil    Max Width  = 9.076mil]: ETH_LINE_CFILT_N, ETH_LINE_CFILT_P, ETH_LINE_DCFILT_N, ETH_LINE_DCFILT_P, ETH_LINE_N, ETH_LINE_P

### Notes on the sheet
- max power 43mW at 3.3V
- (near IC5) max power 215mW at 3.3V
- Project/Equipment
- Document
- Designer
- Drawn by
- Check.by
- Copyright WUT ISE 2021.
  This documentation describes Open Hardware and is licensed under the CERN OHL v.1.1. You may redistribute and modify this documentation under the terms of the CERN OHL v.1.1. (http://ohwr.org/CERNOHL). This documentation is distributed WITHOUT ANY EXPRESS OR IMPLIED WARRANTY, INCLUDING OF MERCHANTABILITY, SATISFACTORY QUALITY AND FITNESS FOR A PARTICULAR PURPOSE. Please see the CERN OHL v.1.1 for applicable conditions.
- Contact
- File
- Last Mod.
- Print Date
- Sheet
- Size
- A3
- of
- Rev

### Library data of the parts
C17 = CC0805_10UF_35V_10%_X5R_MURATA_GRM21BR6YA106KE43L: Non-polarised capacitor; Part Description: Chip Multilayer Ceramic Capacitor for General Purpose; Manufacturer: MURATA; Voltage: 35V; TC: X5R; Tolerance: ±10%; Part Number: CC0805_10UF_35V_10%_X5R_MURATA_GRM21BR6YA106KE43L; Component Kind: Standard; Component Type: Standard; Pin Count: 2; Value: 10uF; Status: Not Recommended; Manufacturer Part Number: GRM21BR6YA106KE43; Case: 0805; Mounted: Yes; Socket: No; SMD: Yes; Sense: No; ComponentHeight: 1.45mm; HelpURL: \\cern.ch\dfs\Applications\Altium\Datasheets\CC0805_MURATA_GRM21BR6YA106KE43L.pdf; Author: CERN DEM BC; CreateDate: 24.03.2020; LatestRevisionDate: 24.03.2020
C18 C19 = CC0402_100NF_50V_10%_X7R: Non-polarised capacitor; Part Number: CC0402_100NF_50V_10%_X7R; Value: 100nF
C20 C21 = CC0805_220NF_100V_10%_X7R: Non-polarised capacitor; Part Description: SMD Multilayer Chip Ceramic Capacitor; Manufacturer: GENERIC; Manufacturer1 Part Number: GRM21AR72A224KAC5L; Voltage: 100V; TC: X7R; Tolerance: ±10%; Part Number: CC0805_220NF_100V_10%_X7R; Component Kind: Standard; Component Type: Standard; Pin Count: 2; Value: 220nF; Status: Preferred; Manufacturer Part Number: CC0805_220NF_100V_10%_X7R; Case: 0805; Mounted: Yes; Socket: No; SMD: Yes; Sense: No; Manufacturer1 Example: MURATA; Manufacturer1 ComponentHeight: 1mm; HelpURL: \\cern.ch\dfs\Applications\Altium\Datasheets\CC0805_MURATA_GRM21AR72A224KAC5L.pdf; Author: CERN DEM JLC; CreateDate: 08.06.2017; LatestRevisionDate: 08.06.2017
C22 C24 C25 = CC0402_2.2UF_6.3V_10%_X5R: Non-polarised capacitor; Part Number: CC0402_2.2UF_6.3V_10%_X5R; Value: 2.2uF
C23 C26 C27 = CC0402_100NF_16V_10%_X7R: as C4 on sheet mcu; Part Number: CC0402_100NF_16V_10%_X7R; Component Kind: Standard; Component Type: Standard; Pin Count: 2; Value: 100nF; Status: Not Recommended; Manufacturer Part Number: CC0402_100NF_16V_10%_X7R; Case: 0402; Mounted: Yes; Socket: No; SMD: Yes; Sense: No; Manufacturer1 Example: MURATA; Manufacturer1 ComponentHeight: 0.55mm; HelpURL: \\cern.ch\dfs\Applications\Altium\Datasheets\CC0402_X7R_MURATA_GRM.pdf; Author: CERN DEM JLC; CreateDate: 05.12.2013; LatestRevisionDate: 03.12.2007
D4 D5 = ESD7241N2T5G: Ultra-Low Capacitance ESD Protection Ultra-Low Capacitance ESD Protection; Manufacturer: ON Semiconductor; Number of Bidirectional Channels: 1; Reverse Standoff Voltage: 24V; Min Breakdown Voltage: 24.3V; Clamping Voltage: 48V; Power Line Protection: No; Supplier 1: Mouser; Manufacturer Part Number: ESD7241N2T5G; RoHS: Yes; Category: ESD and Circuit Protection ICs; Stock 1: 26036; Pricing 1: 1=0,37000, 10=0,30200, 50=0,30200, 100=0,20600, 1000=0,11600, 10000=0,09300 (USD); Mount: Surface Mount; Number of Pins: 2; Min Operating Temperature: -55°C; Max Operating Temperature: 150°C; Resistor Type: Zener; Packaging: Cut Tape; ComponentLink1URL: http://www.farnell.com/datasheets/2907080.pdf?src-supplier=Farnell; ComponentLink1Description: http://www.farnell.com/datasheets/2907080.pdf?src-supplier=Farnell; ComponentLink2URL: http://www.onsemi.com/pub/Collateral/ESD7241-D.PDF?src-supplier=Digi-Key; ComponentLink2Description: http://www.onsemi.com/pub/Collateral/ESD7241-D.PDF?src-supplier=Digi-Key; Supplier Part Number 1: 863-ESD7241N2T5G
IC5 = NCN26010XMNTXG: Ethernet Controller, 10 Mb/s, Single-Pair, MAC + PHY, 802.3cg, 10BASE−T1S Compliant; Manufacturer: ON Semiconductor; Supplier 1: Arrow Electronics; Manufacturer Part Number: NCN26010XMNTXG; RoHS: No; Stock 1: 369; Pricing 1: 1=7,29220, 10=6,57460, 25=6,24800, 100=5,59360, 250=5,34180 (USD); Supplier Part Number 1: NCN26010XMNTXG
L4 = IND_3.3UH_20%_COILCRAFT_LPD5030: Inductor Common Mode; Part Number: LPD5030-154MRC; Part Description: Coupled Inductors for SEPIC Applications, LPD5030 Series; Power: 0.28A; Resistance: 2R43; Tolerance: ±20%; Component Kind: Standard; Component Type: Standard; Pin Count: 2; Value: 150uH; Manufacturer: COILCRAFT; Manufacturer Part Number: LPD5030-154MRC; Mounted: Yes; Socket: No; SMD: Yes; Sense: No; ComponentHeight: 1.2mm; HelpURL: \\cern.ch\dfs\Applications\Altium\Datasheets\IND_COILCRAFT_LPD5030.pdf; Author: CERN DEM JLC; CreateDate: 25.09.2018; LatestRevisionDate: 25.09.2018
L5 = CMP-06045-000003-1: 200UH-20%/+50% (AT 0.1MHZ)70MA R; Manufacturer: Murata; Inductance: 200uH; Automotive Grade: Grade 1; Tolerance: -20/+50%; Value: 200uH; Series Resistance: 4.8Ω; Automotive: Yes; Manufacturer Part Number: DLW32MH201XK2L; Temperature Range Low: -40°C; ComponentLink2URL: https://www.murata.com/products/productdata/8801029685278/QFLC9124.pdf?1544104811000; Lead Free: Yes; Device Class L3: Common Mode Chokes; Device Class L2: EMI / RFI Components; Rms Current: 70mA; Octopart: https://octopart.com/dlw32mh201xk2l-murata-91401020; Digikey Description: 200UH-20%/+50% (AT 0.1MHZ)70MA R; Temperature: -40°C to +125°C; Test Frequency: 0.1MHz; Category: Ind; Package: 0; Temperature Range High: +125°C; ComponentLink2Description: Datasheet; Device Class L1: Passive Components; RoHS: TRUE; Composition: Wirewound; Height: 2.5mm; Mouser Description: Common Mode Chokes Dual 200uH 100kHz 0.07A 4.8Ohm DCR SMD Automotive T/R
L6 = IND0603_WURTH_74279266: Part Description: SMD EMI Suppression Chip Ferrite Bead (WE-CBF Series); Manufacturer: WURTH ELEKTRONIK; Power: 200mA; Resistance: 0.6R; Tolerance: ±25%; Part Number: IND0603_WURTH_74279266; Component Kind: Standard; Component Type: Standard; Pin Count: 2; Value: 1k@100MHz; Manufacturer Part Number: 74279266; Case: 0603; Mounted: Yes; Socket: No; SMD: Yes; Sense: No; ComponentHeight: 1mm; HelpURL: \\cern.ch\dfs\Applications\Altium\Datasheets\IND0603_WURTH_74279266.pdf; Author: CERN DEM JLC; CreateDate: 08.03.2011; LatestRevisionDate: 25.10.2018
LD1 = LED_LITEON_LTST-C193KGKT-5A: LED Green 1C 2A; Part Description: Extra Thin SMD Chip LED, Ultra Bright AlInGaP Green, Lens Water Clear; Manufacturer: LITE-ON SEMICONDUCTOR; PressFit: No; Bonding: No; Part Number: LED_LITEON_LTST-C193KGKT-5A; Component Kind: Standard; Component Type: Standard; Color: Green; PackageDescription: SMD AlInGaP Green LED, Lens Water Clear, 2-Leads, Body 1.6x0.8mm; Manufacturer Part Number: LTST-C193KGKT-5A; Pin Count: 2; Case: 0603; Mounted: Yes; Socket: No; SMD: Yes; Sense: No; ComponentHeight: 0.35mm; HelpURL: \\cern.ch\dfs\Applications\Altium\Datasheets\LED_LITEON_LTST-C193KGKT-5A.pdf; Author: CERN DEM BC; CreateDate: 11.11.2020; LatestRevisionDate: 11.11.2020
LD2 = LED_LITEON_LTST-C193KSKT-5A: LED Yellow 1C 2A; Part Description: Extra Thin SMD Chip LED, Ultra Bright AlInGaP Yellow, Lens Water Clear; Manufacturer: LITE-ON SEMICONDUCTOR; PressFit: No; Bonding: No; Part Number: LED_LITEON_LTST-C193KSKT-5A; Component Kind: Standard; Component Type: Standard; Color: Yellow; PackageDescription: SMD AlInGaP Yellow LED, Lens Water Clear, 2-Leads, Body 1.6x0.8mm; Manufacturer Part Number: LTST-C193KSKT-5A; Pin Count: 2; Case: 0603; Mounted: Yes; Socket: No; SMD: Yes; Sense: No; ComponentHeight: 0.35mm; HelpURL: \\cern.ch\dfs\Applications\Altium\Datasheets\LED_LITEON_LTST-C193KSKT-5A.pdf; Author: CERN DEM BC; CreateDate: 11.11.2020; LatestRevisionDate: 11.11.2020
OSC2 = OSC_25MHZ_ABRACON_ASE-25.000MHZ-LC: Oscillator 4 pins 1=STBY 2=GND 3=OUT 4=VDD; Part Number: ASE-25.000MHZ-LR-T; Part Description: 3.3V, ±50ppm, 15pF, -40..+85°C, CMOS SMD Crystal Oscillator, ASE Series; PressFit: No; Bonding: No; Component Kind: Standard; Component Type: Standard; PackageDescription: SMD Oscillator, Body 3.20mm L X 2.50mm W X 1.20mm H, ASE Serie; Value: 25MHz; Manufacturer: ABRACON; Manufacturer Part Number: ASE-25.000MHZ-LR-T; Pin Count: 4; Mounted: Yes; Socket: No; SMD: Yes; Sense: No; ComponentHeight: 1.2mm; HelpURL: \\cern.ch\dfs\Applications\Altium\Datasheets\XTAL_ABRACON_ASE.pdf; Author: CERN DEM HF; CreateDate: 11.01.2022; LatestRevisionDate: 11.01.2022
P1 = 691347000002B: WR-TBL Series 3470B PCB Header Vertical cable entry, THT, pitch 2.5mm, 2p; Manufacturer: Wurth Elektronik; Modularity: No; Rated Current: 6A; Working Voltage: 150V; ComponentLink1Description: Website Link; ComponentLink1URL: https://www.we-online.com/redexpert/article/691347000002B?ad; ComponentLink2Description: Datasheet Link; ComponentLink2URL: https://www.we-online.com/redexpert/spec/691347000002B?ad; Manufacturer Part Number: 691347000002B; Category: Terminal Blocks; Match Code: WR-TBL; Mount: Through Hole; Operating Temperature Max: 105°C; Operating Temperature Min: -40°C; Packaging: Carton; Application: Plug Screwless Push In; Number of Pins: 2; Number of Rows: 1; Orientation: Vertical Cable Entry; Pitch: 2.5mm
R8 = R0402_10K_1%_0.0625W_100PPM: Resistor - 1%; Part Description: General Purpose Thick Film Chip Resistor; Manufacturer: GENERIC; Manufacturer1 Part Number: 232270671003L; TC: ±100ppm/°C; PressFit: No; Part Number: R0402_10K_1%_0.0625W_100PPM; Component Kind: Standard; Component Type: Standard; Pin Count: 2; Value: 10k; Status: Not Recommended; Power: 0.0625W; Manufacturer Part Number: R0402_10K_1%_0.0625W_100PPM; Case: 0402; Mounted: Yes; Sense: No; Socket: No; SMD: Yes; Manufacturer1 Example: YAGEO PHYCOMP; Manufacturer1 ComponentHeight: 0.4mm; HelpURL: \\cern.ch\dfs\Applications\Altium\Datasheets\R0402_Phycomp_RC0402.pdf; Author: CERN DEM JLC; CreateDate: 03.12.2007; LatestRevisionDate: 17.10.2012
R9 = R0603_3K3_1%_0.1W_100PPM: Resistor - 1%; Part Description: General Purpose Thick Film Chip Resistor; Manufacturer: GENERIC; Manufacturer1 Part Number: NRC06F3301TRF; Power: 0.1W; TC: ±100ppm/°C; PressFit: No; Part Number: R0603_3K3_1%_0.1W_100PPM; Component Kind: Standard; Component Type: Standard; Pin Count: 2; Value: 3k3; Status: Preferred; Manufacturer Part Number: R0603_3K3_1%_0.1W_100PPM; Case: 0603; Mounted: Yes; Sense: No; Socket: No; SMD: Yes; Manufacturer1 Example: NIC COMPONENT; Manufacturer1 ComponentHeight: 0.55mm; HelpURL: \\cern.ch\dfs\Applications\Altium\Datasheets\R0603_NIC_NRC.pdf; Author: CERN DEM JLC; CreateDate: 03.12.2007; LatestRevisionDate: 13.03.2008
R10 R11 = R0603_49R9_0.1%_0.063W_10PPM: Resistor - 0.1%; Part Description: Thin Film Chip Resistor; Manufacturer: GENERIC; Manufacturer1 Part Number: RN73C1J49R9BTDF; Power: 0.063W; TC: ±10ppm; PressFit: No; Part Number: R0603_49R9_0.1%_0.063W_10PPM; Component Kind: Standard; Component Type: Standard; Pin Count: 2; Value: 49R9; Status: Not Recommended; Manufacturer Part Number: R0603_49R9_0.1%_0.063W_10PPM; Case: 0603; Mounted: Yes; Sense: No; Socket: No; SMD: Yes; Manufacturer1 Example: TYCO HOLSWORTHY; Manufacturer1 ComponentHeight: 0.5mm; HelpURL: \\cern.ch\dfs\Applications\Altium\Datasheets\R0603_Tyco_RN73.pdf; Author: CERN DEM JLC; CreateDate: 03.12.2007; LatestRevisionDate: 13.03.2008
R12 = R0402_3K3_1%_0.0625W_100PPM: Resistor - 1%; Part Description: General Purpose Thick Film Chip Resistor; Manufacturer: GENERIC; Manufacturer1 Part Number: 232270673302L; TC: ±100ppm/°C; PressFit: No; Part Number: R0402_3K3_1%_0.0625W_100PPM; Component Kind: Standard; Component Type: Standard; Pin Count: 2; Value: 3k3; Status: Not Recommended; Power: 0.0625W; Manufacturer Part Number: R0402_3K3_1%_0.0625W_100PPM; Case: 0402; Mounted: Yes; Sense: No; Socket: No; SMD: Yes; Manufacturer1 Example: YAGEO PHYCOMP; Manufacturer1 ComponentHeight: 0.4mm; HelpURL: \\cern.ch\dfs\Applications\Altium\Datasheets\R0402_Phycomp_RC0402.pdf; Author: CERN DEM JLC; CreateDate: 03.12.2007; LatestRevisionDate: 17.10.2012
R13 = R0402_2K_1%_0.0625W_100PPM: Resistor - 1%; Part Description: General Purpose Thick Film Chip Resistor; Manufacturer: GENERIC; Manufacturer1 Part Number: 232270672002L; TC: ±100ppm/°C; PressFit: No; Part Number: R0402_2K_1%_0.0625W_100PPM; Component Kind: Standard; Component Type: Standard; Pin Count: 2; Value: 2k; Status: Not Recommended; Power: 0.0625W; Manufacturer Part Number: R0402_2K_1%_0.0625W_100PPM; Case: 0402; Mounted: Yes; Sense: No; Socket: No; SMD: Yes; Manufacturer1 Example: YAGEO PHYCOMP; Manufacturer1 ComponentHeight: 0.4mm; HelpURL: \\cern.ch\dfs\Applications\Altium\Datasheets\R0402_Phycomp_RC0402.pdf; Author: CERN DEM JLC; CreateDate: 03.12.2007; LatestRevisionDate: 17.10.2012
SW1#2 = 450301014042: WS-SLTV THT Mini Slide Switch, Opposite Side Connection, SPDT, 12VDC, 500mA, 800g; Manufacturer: Wurth Elektronik; ComponentLink1Description: Website Link; ComponentLink1URL: https://www.we-online.com/redexpert/article/450301014042?ad; ComponentLink2Description: Datasheet Link; ComponentLink2URL: https://www.we-online.com/redexpert/spec/450301014042?ad; Manufacturer Part Number: 450301014042; Category: Slide Switches; Match Code: WS-SLTV; Mount: Through Hole; Operating Temperature Max: 85°C; Operating Temperature Min: -40°C; Packaging: Bulk; Length: 10mm; Width: 2.5mm; Height: 6.4mm; Circuit: SPDT; Contact Material: Copper Alloy; Contact Plating: Gold; Operation Force: 800g; Rated Current: 500mA; Rated Voltage: 12VDC; Terminal Material: Copper Alloy; Terminal Plating: Gold

## Sheet b2b_connector.SchDoc: DiPho digital
size 420 x 297 mm; Author: Piotr Daniel; DrawnBy: P. Daniel; Address1: WUT ISE; Address3: piotrmaciejdaniel@gmail.com; Revision: 1; SheetNumber: 4; SheetTotal: 4; Title2: b2b con schematic; Designer: Piotr Daniel; CreateDate: 10-12.2021
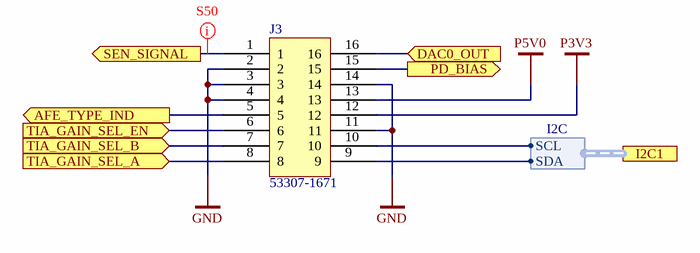
[diagram p3: b2b_connector.SchDoc]

### Parts
J3  53307-1671  [533071671]

### Ports
AFE_TYPE_IND (out), DAC0_OUT (in), I2C1 (harness I2C), PD_BIAS (out), SEN_SIGNAL (out), TIA_GAIN_SEL_A (in), TIA_GAIN_SEL_B (in), TIA_GAIN_SEL_EN (in)

### Harnesses
I2C: SCL, SDA

### Nets
GND: J3.2 J3.3 J3.4 J3.11 J3.14
P3V3: J3.12
P5V0: J3.13
AFE_TYPE_IND: J3.5 ; port AFE_TYPE_IND
DAC0_OUT: J3.16 ; port DAC0_OUT
PD_BIAS: J3.15 ; port PD_BIAS
SCL: J3.10 ; port I2C1.SCL
SDA: J3.9 ; port I2C1.SDA
SEN_SIGNAL: J3.1 ; port SEN_SIGNAL
TIA_GAIN_SEL_A: J3.8 ; port TIA_GAIN_SEL_A
TIA_GAIN_SEL_B: J3.7 ; port TIA_GAIN_SEL_B
TIA_GAIN_SEL_EN: J3.6 ; port TIA_GAIN_SEL_EN

### Layout directives
rule Width Constraint [Pref Impedance = 50,00ohms    Min Impedance = 50,00ohms    Max Impedance = 50,00ohms]: SEN_SIGNAL

### Notes on the sheet
- Project/Equipment
- Document
- Designer
- Drawn by
- Check.by
- Copyright WUT ISE 2021.
  This documentation describes Open Hardware and is licensed under the CERN OHL v.1.1. You may redistribute and modify this documentation under the terms of the CERN OHL v.1.1. (http://ohwr.org/CERNOHL). This documentation is distributed WITHOUT ANY EXPRESS OR IMPLIED WARRANTY, INCLUDING OF MERCHANTABILITY, SATISFACTORY QUALITY AND FITNESS FOR A PARTICULAR PURPOSE. Please see the CERN OHL v.1.1 for applicable conditions.
- Contact
- File
- Last Mod.
- Print Date
- Sheet
- Size
- A3
- of
- Rev

### Library data of the parts
J3 = 53307-1671: 0.80mm Pitch Header Surface Mount Dual Row Vertical Stacking 4.50 and 5.50mm Stacking Heights 16 Circuits; Manufacturer: Molex; Supplier 1: Farnell; Manufacturer Part Number: 53307-1671; RoHS: Yes; Category: Headers and Wire Housings; Stock 1: 7000; ComponentLink1URL: https://datasheet.ciiva.com/5130/0533071671-pcb-headers-170920-5130475.pdf?src-supplier=Mouser; ComponentLink1Description: https://datasheet.ciiva.com/5130/0533071671-pcb-headers-170920-5130475.pdf?src-supplier=Mouser; ComponentLink2URL: https://datasheet.ciiva.com/1440/1875052-1440388.pdf?src-supplier=Element14; ComponentLink2Description: https://datasheet.ciiva.com/1440/1875052-1440388.pdf?src-supplier=Element14; ComponentLink3URL: https://datasheet.ciiva.com/10079/0533071671-pcb-headers-10079144.pdf?src-supplier=Avnet; ComponentLink3Description: https://datasheet.ciiva.com/10079/0533071671-pcb-headers-10079144.pdf?src-supplier=Avnet; Supplier Part Number 1: 3499278

## Nets that join several sheets
GND: mcu (38 pins), ethernet (22 pins), b2b_connector (5 pins)
P3V3: mcu (18 pins), ethernet (11 pins), b2b_connector (J3.12)
P5V0: mcu (8 pins), b2b_connector (J3.13)
PPODL: mcu (C8.2 IC3.4 IC3.6), ethernet (C17.2 L4.2)
AFE_TYPE_IND: mcu (IC2.27), b2b_connector (J3.5)
DAC0_OUT: mcu (IC2.14), b2b_connector (J3.16)
ETH_RST: mcu (IC2.43), ethernet (IC5.13 R9.1)
NetIC2_39: mcu (IC2.39), ethernet (IC5.15)
NetIC2_40: mcu (IC2.40), ethernet (IC5.23)
NetIC2_41: mcu (IC2.41), ethernet (IC5.18)
NetIC2_42: mcu (IC2.42), ethernet (IC5.16 R8.1)
PD_BIAS: mcu (IC2.11), b2b_connector (J3.15)
SCL: mcu (IC2.30 R1.1), b2b_connector (J3.10)
SDA: mcu (IC2.31 R2.1), b2b_connector (J3.9)
SEN_SIGNAL: mcu (IC2.10), b2b_connector (J3.1)
SPI1_NSS: mcu (IC2.38), ethernet (IC5.19)
TIA_GAIN_SEL_A: mcu (IC2.22), b2b_connector (J3.8)
TIA_GAIN_SEL_B: mcu (IC2.25), b2b_connector (J3.7)
TIA_GAIN_SEL_EN: mcu (IC2.26), b2b_connector (J3.6)